# Altium project arduino_sh.PrjPcb
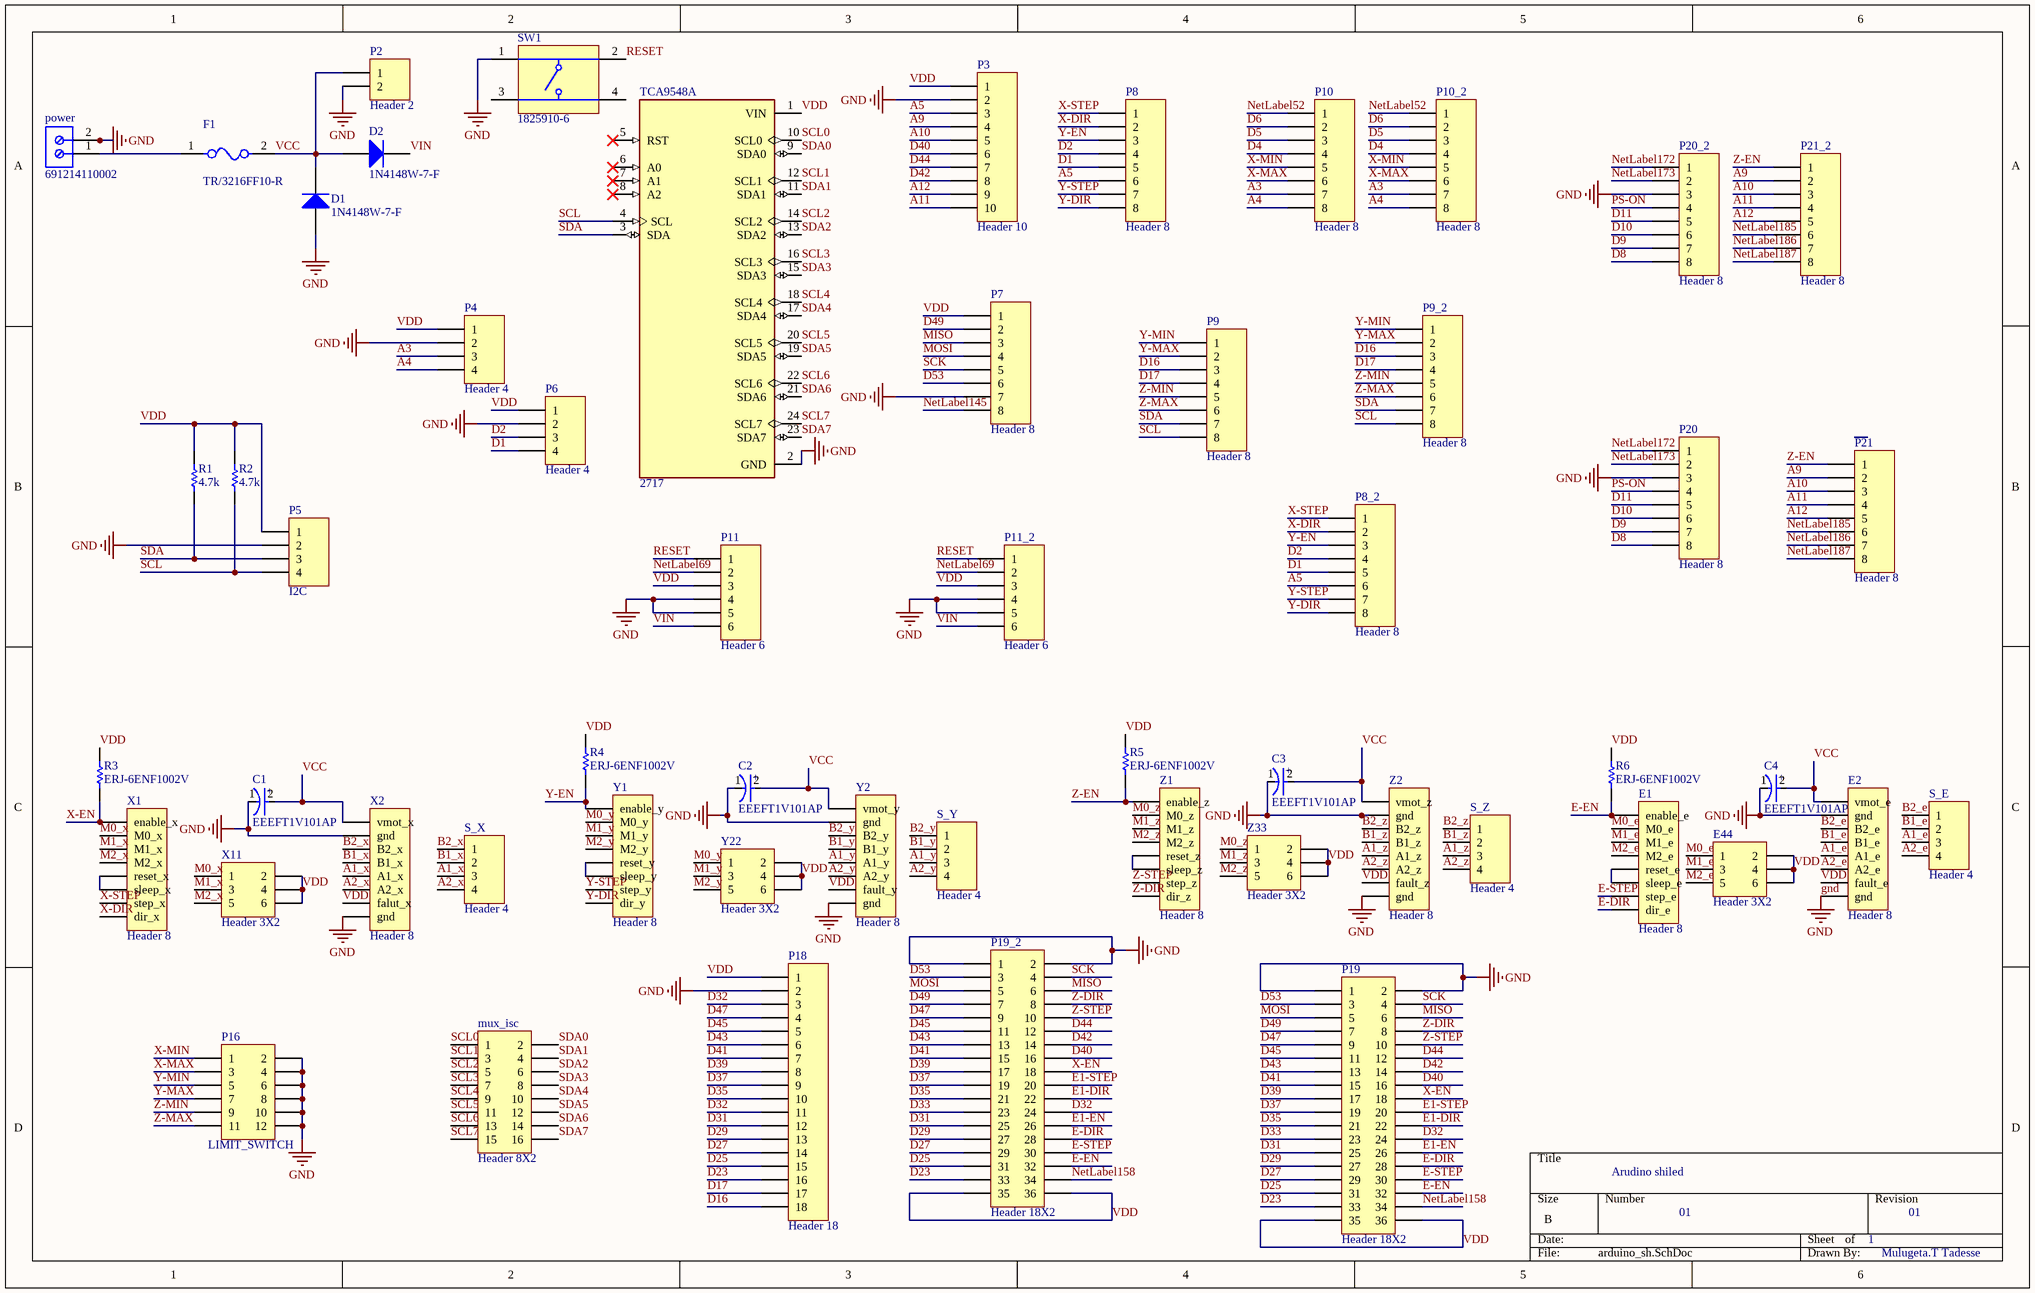
[diagram p0: arduino_sh.SchDoc]
1 sheet, 55 parts. Net scope: global (net labels, ports and power ports of the same name join across sheets).
Board file: arduino_sh.PcbDoc

## Sheet arduino_sh.SchDoc: Arudino shiled
size B; DrawnBy: Mulugeta.T Tadesse; DocumentNumber: 01; Revision: 01; SheetNumber: 1; SheetTotal: 1; SPICEModelCacheCCLHVTLP: <root> / <DocumentId>CCLHVTLP</DocumentId> / </root>

### Parts
C1  EEEFT1V101AP  [FP-FTD-MFG]
C2  EEEFT1V101AP  [FP-FTD-MFG]
C3  EEEFT1V101AP  [FP-FTD-MFG]
C4  EEEFT1V101AP  [FP-FTD-MFG]
D1  1N4148W-7-F  [DIOD-SOD123-2_V]
D2  1N4148W-7-F  [DIOD-SOD123-2_V]
E1  Header 8  [HDR1X8]
E2  Header 8  [HDR1X8]
E44  Header 3X2  [HDR2X3]
F1  TR/3216FF10-R  [FP-3216FF-MFG]
mux_isc  Header 8X2  [HDR2X8]
P2  Header 2  [HDR1X2]
P3  Header 10  [HDR1X10]
P4  Header 4  [HDR1X4]
P5  I2C  [HDR1X4]
P6  Header 4  [HDR1X4]
P7  Header 8  [HDR1X8]
P8  Header 8  [HDR1X8]
P8_2  Header 8  [HDR1X8]
P9  Header 8  [HDR1X8]
P9_2  Header 8  [HDR1X8]
P10  Header 8  [HDR1X8]
P10_2  Header 8  [HDR1X8]
P11  Header 6  [HDR1X6]
P11_2  Header 6  [HDR1X6]
P16  LIMIT_SWITCH  [HDR2X6]
P18  Header 18  [HDR1X18]
P19  Header 18X2  [HDR2X18]
P19_2  Header 18X2  [HDR2X18]
P20  Header 8  [HDR1X8]
P20_2  Header 8  [HDR1X8]
P21  Header 8  [HDR1X8]
P21_2  Header 8  [HDR1X8]
power  691214110002  [691214110002]
R1  4.7k  [RESC2013X70X40ML20T20]
R2  4.7k  [RESC2013X70X40ML20T20]
R3  ERJ-6ENF1002V  [RESC2013X70X40ML20T20]
R4  ERJ-6ENF1002V  [RESC2013X70X40ML20T20]
R5  ERJ-6ENF1002V  [RESC2013X70X40ML20T20]
R6  ERJ-6ENF1002V  [RESC2013X70X40ML20T20]
S_E  Header 4  [HDR1X4]
S_X  Header 4  [HDR1X4]
S_Y  Header 4  [HDR1X4]
S_Z  Header 4  [HDR1X4]
SW1  1825910-6  [TECO-1825910-6_V]
TCA9548A  2717  [MODULE_2717]
X1  Header 8  [HDR1X8]
X2  Header 8  [HDR1X8]
X11  Header 3X2  [HDR2X3]
Y1  Header 8  [HDR1X8]
Y2  Header 8  [HDR1X8]
Y22  Header 3X2  [HDR2X3]
Z1  Header 8  [HDR1X8]
Z2  Header 8  [HDR1X8]
Z33  Header 3X2  [HDR2X3]

### Nets
gnd: C1.1(C) C2.1(C) C3.1(C) C4.1(C) D1.1(A) E2.2(gnd) E2.8(gnd) P2.2 P3.2 P4.2 P5.2 P6.2 P7.7 P11.4 P11.5 P11_2.4 P11_2.5 P16.2 P16.4 P16.6 P16.8 P16.10 P16.12 P18.2 P19.1 P19.2 P19_2.1 P19_2.2 P20.3 P20_2.3 power.2 SW1.1 TCA9548A.2(GND) X2.2(gnd) X2.8(gnd) Y2.2(gnd) Y2.8(gnd) Z2.2(gnd) Z2.8(gnd)
A1_e: E2.5(A1_e) S_E.3
A1_x: S_X.3 X2.5(A1_x)
A1_y: S_Y.3 Y2.5(A1_y)
A1_z: S_Z.3 Z2.5(A1_z)
A2_e: E2.6(A2_e) S_E.4
A2_x: S_X.4 X2.6(A2_x)
A2_y: S_Y.4 Y2.6(A2_y)
A2_z: S_Z.4 Z2.6(A2_z)
A3: P4.3 P10.7 P10_2.7
A4: P4.4 P10.8 P10_2.8
A5: P3.3 P8.6 P8_2.6
A9: P3.4 P21.2 P21_2.2
A10: P3.5 P21.3 P21_2.3
A11: P3.10 P21.4 P21_2.4
A12: P3.9 P21.5 P21_2.5
B1_e: E2.4(B1_e) S_E.2
B1_x: S_X.2 X2.4(B1_x)
B1_y: S_Y.2 Y2.4(B1_y)
B1_z: S_Z.2 Z2.4(B1_z)
B2_e: E2.3(B2_e) S_E.1
B2_x: S_X.1 X2.3(B2_x)
B2_y: S_Y.1 Y2.3(B2_y)
B2_z: S_Z.1 Z2.3(B2_z)
D1: P6.4 P8.5 P8_2.5
D2: P6.3 P8.4 P8_2.4
D4: P10.4 P10_2.4
D5: P10.3 P10_2.3
D6: P10.2 P10_2.2
D8: P20.8 P20_2.8
D9: P20.7 P20_2.7
D10: P20.6 P20_2.6
D11: P20.5 P20_2.5
D16: P9.3 P9_2.3 P18.18
D17: P9.4 P9_2.4 P18.17
D23: P18.16 P19.33 P19_2.33
D25: P18.15 P19.31 P19_2.31
D27: P18.14 P19.29 P19_2.29
D29: P18.13 P19.27 P19_2.27
D31: P18.12 P19.25 P19_2.25
D32: P18.3 P18.11 P19.24 P19_2.24
D33: P19.23 P19_2.23
D35: P18.10 P19.21 P19_2.21
D37: P18.9 P19.19 P19_2.19
D39: P18.8 P19.17 P19_2.17
D40: P3.6 P19.16 P19_2.16
D41: P18.7 P19.15 P19_2.15
D42: P3.8 P19.14 P19_2.14
D43: P18.6 P19.13 P19_2.13
D44: P3.7 P19.12 P19_2.12
D45: P18.5 P19.11 P19_2.11
D47: P18.4 P19.9 P19_2.9
D49: P7.2 P19.7 P19_2.7
D53: P7.6 P19.3 P19_2.3
E1-DIR: P19.22 P19_2.22
E1-EN: P19.26 P19_2.26
E1-STEP: P19.20 P19_2.20
E-DIR: E1.8(dir_e) P19.28 P19_2.28
E-EN: E1.1(enable_e) P19.32 P19_2.32 R6.2
E-STEP: E1.7(step_e) P19.30 P19_2.30
M0_e: E1.2(M0_e) E44.1
M0_x: X1.2(M0_x) X11.1
M0_y: Y1.2(M0_y) Y22.1
M0_z: Z1.2(M0_z) Z33.1
M1_e: E1.3(M1_e) E44.3
M1_x: X1.3(M1_x) X11.3
M1_y: Y1.3(M1_y) Y22.3
M1_z: Z1.3(M1_z) Z33.3
M2_e: E1.4(M2_e) E44.5
M2_x: X1.4(M2_x) X11.5
M2_y: Y1.4(M2_y) Y22.5
M2_z: Z1.4(M2_z) Z33.5
MISO: P7.3 P19.6 P19_2.6
MOSI: P7.4 P19.5 P19_2.5
NetLabel52: P10.1 P10_2.1
NetLabel69: P11.2 P11_2.2
NetLabel145: P7.8
NetLabel158: P19.34 P19_2.34
NetLabel172: P20.1 P20_2.1
NetLabel173: P20.2 P20_2.2
NetLabel185: P21.6 P21_2.6
NetLabel186: P21.7 P21_2.7
NetLabel187: P21.8 P21_2.8
PS-ON: P20.4 P20_2.4
RESET: P11.1 P11_2.1 SW1.2
SCK: P7.5 P19.4 P19_2.4
SCL: P5.4 P9.8 P9_2.8 R2.2 TCA9548A.4(SCL)
SCL0: mux_isc.1 TCA9548A.10(SCL0)
SCL1: mux_isc.3 TCA9548A.12(SCL1)
SCL2: mux_isc.5 TCA9548A.14(SCL2)
SCL3: mux_isc.7 TCA9548A.16(SCL3)
SCL4: mux_isc.9 TCA9548A.18(SCL4)
SCL5: mux_isc.11 TCA9548A.20(SCL5)
SCL6: mux_isc.13 TCA9548A.22(SCL6)
SCL7: mux_isc.15 TCA9548A.24(SCL7)
SDA: P5.3 P9.7 P9_2.7 R1.2 TCA9548A.3(SDA)
SDA0: mux_isc.2 TCA9548A.9(SDA0)
SDA1: mux_isc.4 TCA9548A.11(SDA1)
SDA2: mux_isc.6 TCA9548A.13(SDA2)
SDA3: mux_isc.8 TCA9548A.15(SDA3)
SDA4: mux_isc.10 TCA9548A.17(SDA4)
SDA5: mux_isc.12 TCA9548A.19(SDA5)
SDA6: mux_isc.14 TCA9548A.21(SDA6)
SDA7: mux_isc.16 TCA9548A.23(SDA7)
VCC: C1.2(A) C2.2(A) C3.2(A) C4.2(A) D1.2(K) D2.1(A) E2.1(vmot_e) F1.2 P2.1 X2.1(vmot_x) Y2.1(vmot_y) Z2.1(vmot_z)
VDD: E2.7(fault_e) E44.2 E44.4 E44.6 P3.1 P4.1 P5.1 P6.1 P7.1 P11.3 P11_2.3 P18.1 P19.35 P19.36 P19_2.35 P19_2.36 R1.1 R2.1 R3.1 R4.1 R5.1 R6.1 TCA9548A.1(VIN) X2.7(falut_x) X11.2 X11.4 X11.6 Y2.7(fault_y) Y22.2 Y22.4 Y22.6 Z2.7(fault_z) Z33.2 Z33.4 Z33.6
VIN: D2.2(K) P11.6 P11_2.6
X-DIR: P8.2 P8_2.2 X1.8(dir_x)
X-EN: P19.18 P19_2.18 R3.2 X1.1(enable_x)
X-MAX: P10.6 P10_2.6 P16.3
X-MIN: P10.5 P10_2.5 P16.1
X-STEP: P8.1 P8_2.1 X1.7(step_x)
Y-DIR: P8.8 P8_2.8 Y1.8(dir_y)
Y-EN: P8.3 P8_2.3 R4.2 Y1.1(enable_y)
Y-MAX: P9.2 P9_2.2 P16.7
Y-MIN: P9.1 P9_2.1 P16.5
Y-STEP: P8.7 P8_2.7 Y1.7(step_y)
Z-DIR: P19.8 P19_2.8 Z1.8(dir_z)
Z-EN: P21.1 P21_2.1 R5.2 Z1.1(enable_z)
Z-MAX: P9.6 P9_2.6 P16.11
Z-MIN: P9.5 P9_2.5 P16.9
Z-STEP: P19.10 P19_2.10 Z1.7(step_z)
NetE1_5: E1.5(reset_e) E1.6(sleep_e)
NetF1_1: F1.1 power.1
NetX1_5: X1.5(reset_x) X1.6(sleep_x)
NetY1_5: Y1.5(reset_y) Y1.6(sleep_y)
NetZ1_5: Z1.5(reset_z) Z1.6(sleep_z)

Not connected (* = marked no-connect by the designer): SW1 3 4; TCA9548A 5(RST)* 6(A0)* 7(A1)* 8(A2)*

### Notes on the sheet
- (in symbol CMP-05427-000027-1) +

### Library data of the parts
C1-C4 = CMP-05427-000027-1: CAP ALUM 100UF 20% 35V SMD; Ripple Current: 300mA; Polarity: Polar; Life (Hours): 2000Hour; Lead Diameter: 0.65mm; ESR (Equivalent Series Resistance): 260mR; Leakage Current: 35uA; REACH SVHC: No SVHC; Series: FT; Min Operating Temperature: -55°C; Diameter: 6.3mm; Max Operating Temperature: 105°C; Number of Pins: 2; Package Quantity: 1000; Length: 5.8mm; Lead Pitch: 1.8mm; Voltage: 35V; Construction: Cylindrical; Capacitance: 100uF; Height: 5.8mm; Tolerance: 20%; RoHS Compliant: Yes; Packaging: Tape and Reel; Ripple Current (AC): 300mA; Height - Seated (Max): 0.24inch; Voltage Rating: 35V; Radiation Hardening: No; Contact Plating: Tin; Termination: SMD/SMT; Voltage Rating (DC): 35V; Case/Package: Radial; Mount: Surface Mount
D1 D2 = CMP-2000-04932-2: Fast Switching Diode, 100 V, 0.15 A, -65 to 150 degC, 2-Pin?SOD123, RoHS, Tape and Reel; Recovery Time: 4ns; Brand: DiodesIncorporated; Unit Weight: 0.000353oz; Max Surge Current: 2A; Peak Reverse Voltage: 100V; Ir - Reverse Current: 1uA; Vf - Forward Voltage: 1.25V; Configuration: Single; If - Forward Current: 0.15A; Product Category: Diodes-GeneralPurpose,Power,Switching; Operating Temperature Range: -65Cto+150C; Packaging: Reel; Manufacturer URL: http://www.diodes.com/; Maximum Operating Temperature: +150C; Height: 1.25mm; Minimum Operating Temperature: -65C; Product: SwitchingDiodes; Package URL: http://www.diodes.com/datasheets/ds18004.pdf; Type: SwitchingDiode; Package Reference: SOD123-2; Width: 1.7mm; Datasheet URL: http://www.farnell.com/datasheets/1915529.pdf; Datasheet Version: Rev. 24-2, 10/2013; Series: 1N4148; Factory Pack Quantity: 3000; Length: 2.85mm; RoHS: True; Manufacturer: DiodesIncorporated; Mounting Style: SMD/SMT; Package / Case: SOD-123
E1 E2 P7 P8 P8_2 P9 P9_2 P10 P10_2 P20 P20_2 P21 P21_2 X1 X2 Y1 Y2 Z1 Z2 = Header 8: Header, 8-Pin; LatestRevisionDate: 17-Jul-2002; LatestRevisionNote: Re-released for DXP Platform.; Publisher: Altium Limited
E44 X11 Y22 Z33 = Header 3X2: Header, 3-Pin, Dual row; LatestRevisionDate: 17-Jul-2002; LatestRevisionNote: Re-released for DXP Platform.; Publisher: Altium Limited
F1 = CMP-03047-09453137-1: TR/3216FF10-R 10 A AC 24 V DC Fuse Board Mount (Cartridge Style Excluded) Surface Mount 1206 (3216 Metric); Max Voltage Rating (DC): 24V; Fuse Current: 10A; Voltage Rating (AC): 32V; Resistance: 4.5mΩ; Approvals: CSA, UR; Max Operating Temperature: 125°C; RoHS: Compliant; Packaging: Cut Tape; Case/Package: 1206; Min Operating Temperature: -55°C; Schedule B: 8536100040, 8536100040; Voltage Rating (DC): 24V; Depth: 1.6mm; REACH SVHC: No SVHC; Mount: Surface Mount; Number of Pins: 2; Termination: SMD/SMT; Length: 3.2mm; Width: 1.6mm; Current Rating: 10A; Height: 889µm; NexarPartId: 9453137; Weight: 453.59237mg; Radiation Hardening: No; Voltage Rating: 24V
mux_isc = Header 8X2: Header, 8-Pin, Dual row; LatestRevisionDate: 17-Jul-2002; LatestRevisionNote: Re-released for DXP Platform.; Publisher: Altium Limited
P2 = Header 2: Header, 2-Pin; LatestRevisionDate: 17-Jul-2002; LatestRevisionNote: Re-released for DXP Platform.; Publisher: Altium Limited
P3 = Header 10: Header, 10-Pin; LatestRevisionDate: 17-Jul-2002; LatestRevisionNote: Re-released for DXP Platform.; Publisher: Altium Limited
P4-P6 S_E S_X S_Y S_Z = Header 4: Header, 4-Pin; LatestRevisionDate: 17-Jul-2002; LatestRevisionNote: Re-released for DXP Platform.; Publisher: Altium Limited
P11 P11_2 = Header 6: Header, 6-Pin; LatestRevisionDate: 17-Jul-2002; LatestRevisionNote: Re-released for DXP Platform.; Publisher: Altium Limited
P16 = Header 6X2: Header, 6-Pin, Dual row; LatestRevisionDate: 17-Jul-2002; LatestRevisionNote: Re-released for DXP Platform.; Publisher: Altium Limited
P18 = Header 18: Header, 18-Pin; LatestRevisionDate: 17-Jul-2002; LatestRevisionNote: Re-released for DXP Platform.; Publisher: Altium Limited
P19 P19_2 = Header 18X2: Header, 18-Pin, Dual row; LatestRevisionDate: 17-Jul-2002; LatestRevisionNote: Re-released for DXP Platform.; Publisher: Altium Limited
power = CMP-1502-02464-2: NexarPartId: 18818288; Plating: Brass, Steel; Current: 10A; Pitch: 3.5052mm; Number of Levels: 1; Number of Contacts: 2; Wire Gauge (Min): 16AWG; Voltage: 300V; Wire Gauge (Max): 24AWG; Stripping Length: -6mm; Number of Pins: 2; Number of Rows: 1; REACH SVHC: Unknown; RoHS: Compliant; Housing Material: Nylon; Termination: Screw; Mount: Through Hole; Contact Plating: Brass, Tin; Number of Positions Per Level: 2; Color: Blue, Green; Width: 7.9mm; Voltage Rating: 300V; Length: 7.4mm; Current Rating: 10A; Wire/Cable Gauge: 24AWG; Packaging: Box; Max Operating Temperature: 105°C; Lead Pitch: 3.5mm; Height: 8.7mm; Contact Material: Brass; Min Operating Temperature: -40°C
R1 R2 = CMP-2001-04376-1: Manufacturer: Panasonic; Part Number: ERJ-6ENF1002V
R3-R6 = CMP-2001-04376-1: Manufacturer: Panasonic; Part Number: ERJ-6ENF1002V
SW1 = CMP-1684-00021-1: Tact Switch, SPST-NO, 0.05 A, -35 to 85 degC, 4-Pin THD, RoHS, Bulk; Manufacturer: TE Connectivity; Maximum Contact Resistance: 100mOhm; Mechanical Life: 100000Cycles; Bushing Type: Unthreaded; Switch Configuration: OFF(ON); Maximum DC Voltage Rating: 24V; Contact Rating @ Voltage: 0.05A@24VDC; Actuator Color: Black; Body Orientation: Straight; Function: MomentaryContact; Illumination: N/R; Actuator Style: RoundButton; Actuator Material: PolybutyleneTerephthalate; Dielectric Strength: 500VAC; Pole Throw Configuration: SPST; Actuator Length: 1.4mm; Product Weight: N/A; Contact Material: CopperAlloy; Housing Material: N/A; Terminal Type: PCPins; Minimum Insulation Resistance: 100MOhm; Package Description: 4-Pin Through Hole Device, Body 5.99 x 5.99 mm, Pitch 6.5 mm; Part No: 1825910-6; Package Reference: THD; Base Material: N/A; Manufacturer URL: http://www.te.com; Contact Plating: Silver; RoHS: Yes; Datasheet Version: Rev. C9; Electrical Life: 100000Cycles; Maximum AC Voltage Rating: N/A; Thread Size: N/R; Operating Temperature: -35to85C; Mounting: ThroughHole; Dimension: 5.99x5mm; Datasheet URL: http://www.te.com/commerce/DocumentDelivery/DDEController?Action=showdoc&DocId=Customer+Drawing%7F1825910%7FC9%7Fpdf%7FEnglish%7FENG_CD_1825910_C9.pdf%7F1825910-6; Family: 1825910; Seal Location: N/A; Seal Description: N/A; Packaging: N/A
TCA9548A = 2717: Module: multiplexer; I2C interface multiplexer; TCA9548A; 3Ã·5VDC; MF: Adafruit; SnapEDA_Link: https://www.snapeda.com/parts/2717/Adafruit+Industries+LLC/view-part/?ref=snap; Availability: In Stock; Purchase-URL: https://pricing.snapeda.com/search/part/2717/?ref=eda; Check_prices: https://www.snapeda.com/parts/2717/Adafruit+Industries+LLC/view-part/?ref=eda; Value: *; Package: None; MP: 2717; Price: None